# EAGLE design outseal328 (EAGLE 7.4.0)
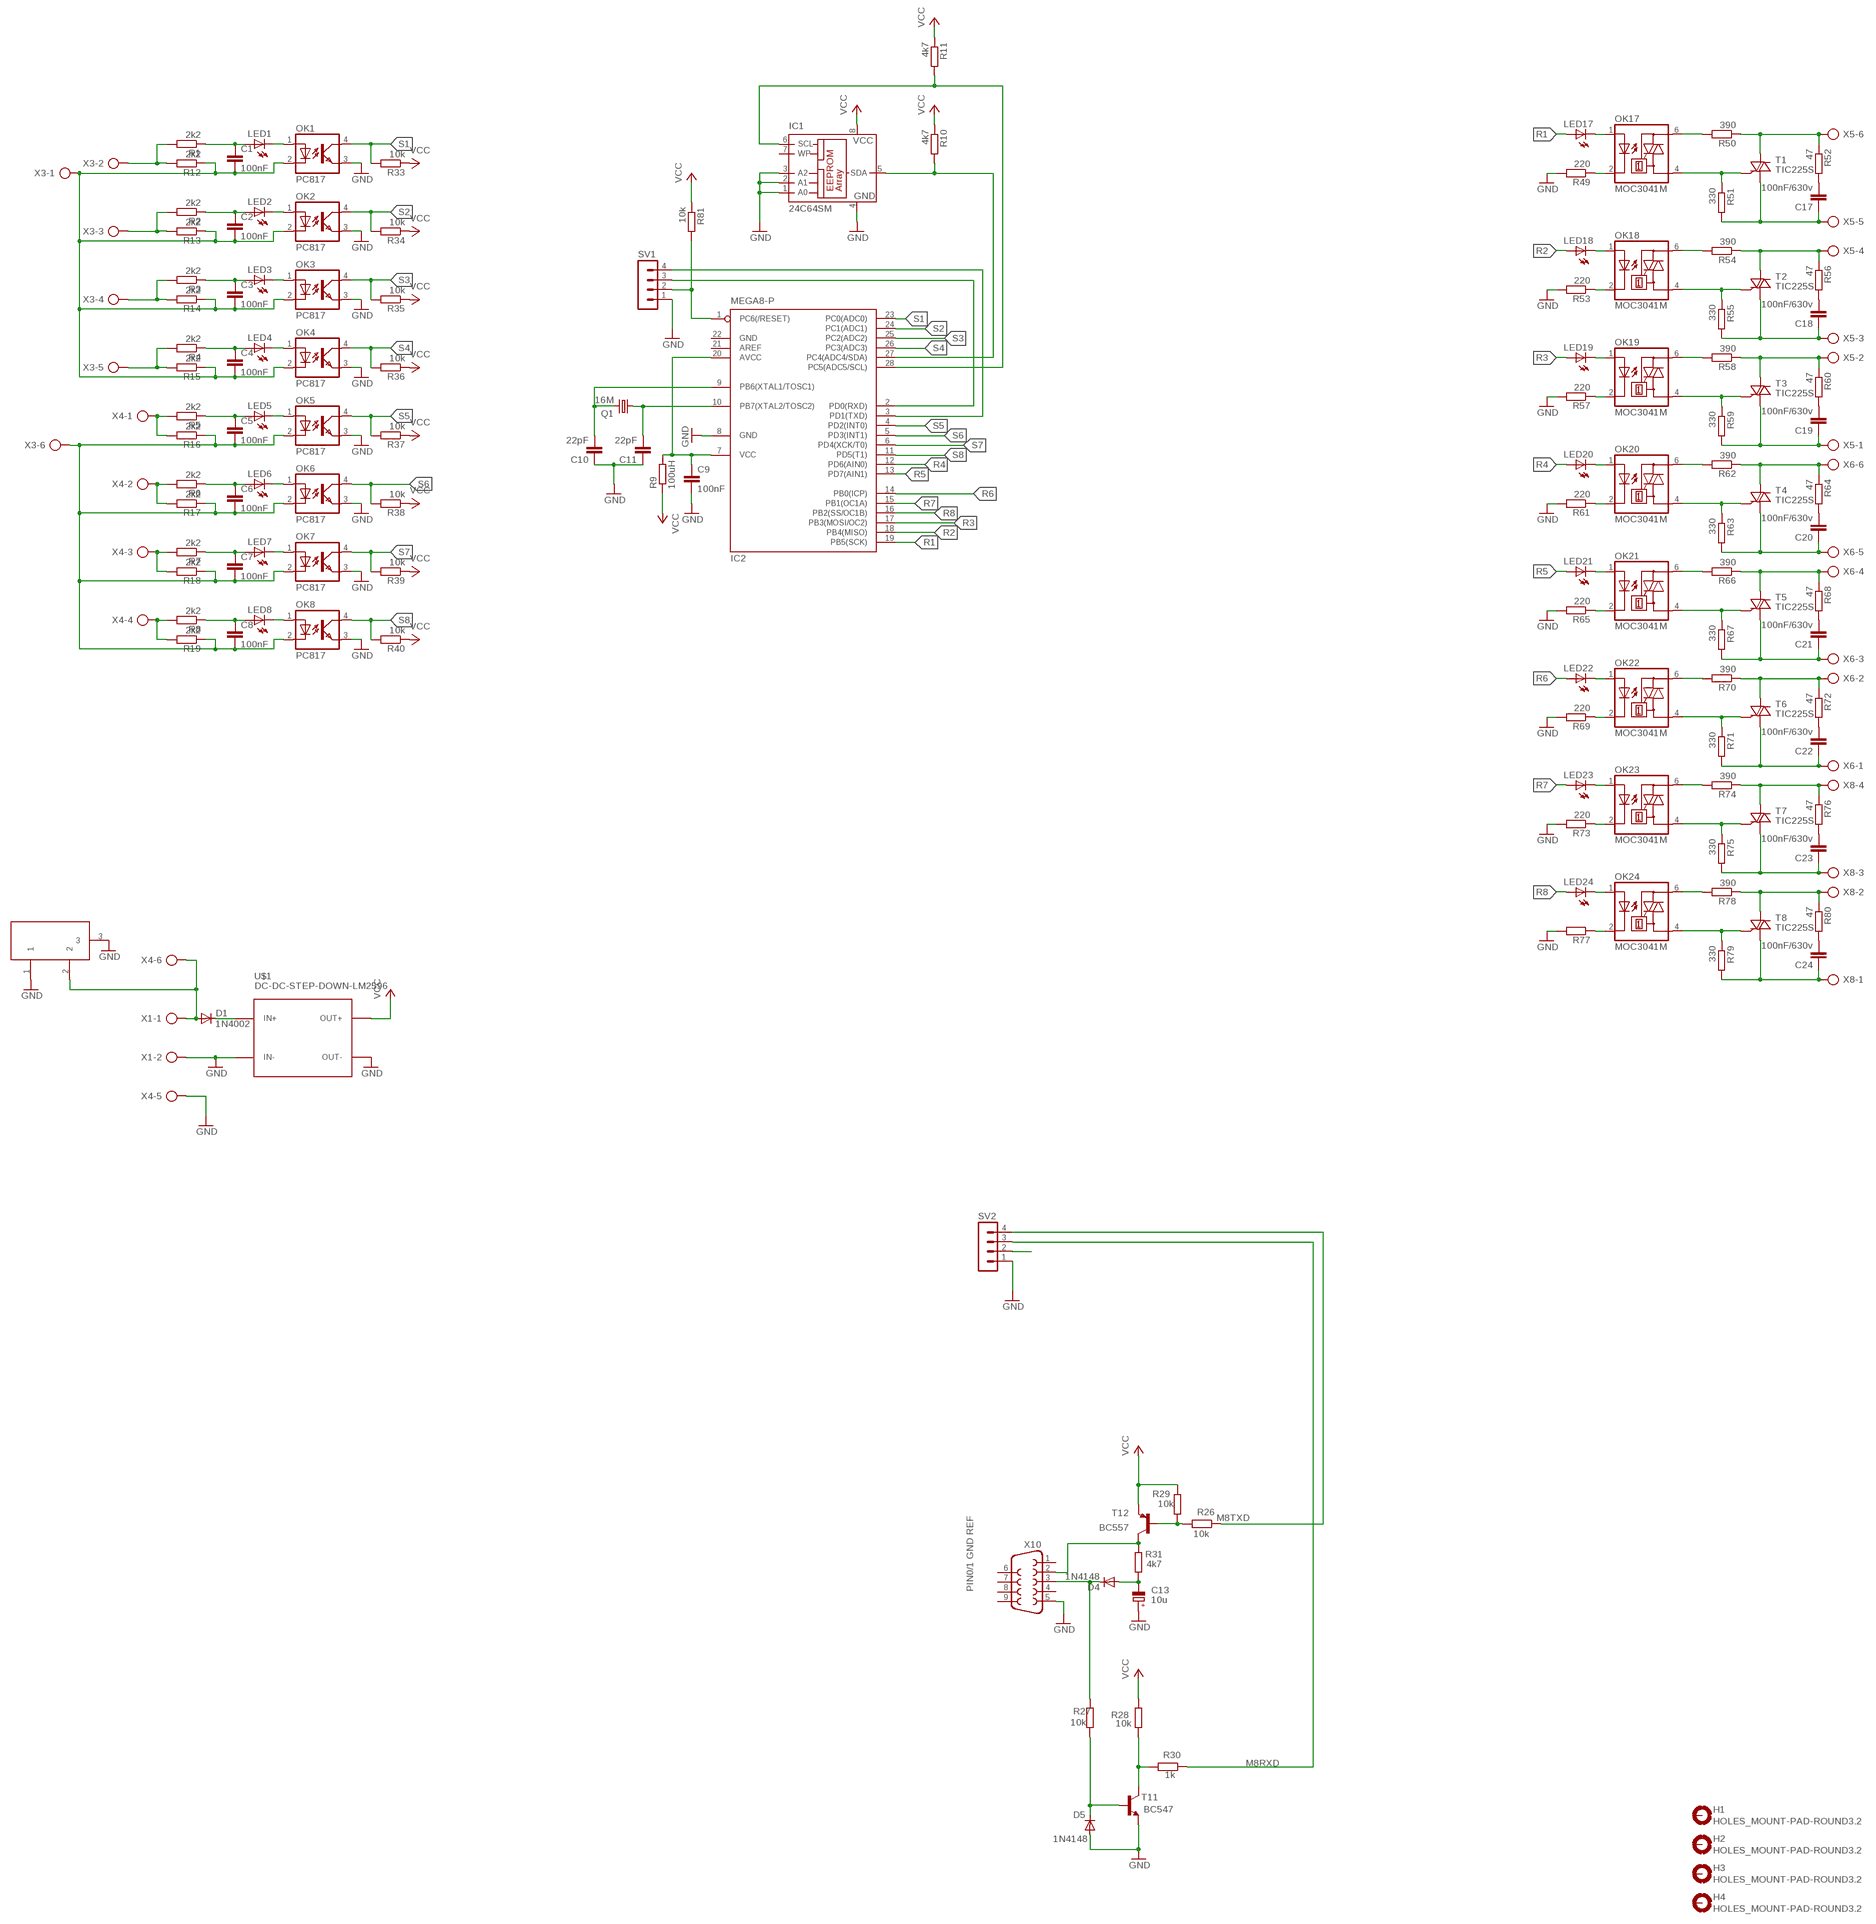
[diagram p0: schematic, sheet 1]

## Parts
C1  100nF  C-EU050-025X075  [C050-025X075]
C2  100nF  C-EU050-025X075  [C050-025X075]
C3  100nF  C-EU050-025X075  [C050-025X075]
C4  100nF  C-EU050-025X075  [C050-025X075]
C5  100nF  C-EU050-025X075  [C050-025X075]
C6  100nF  C-EU050-025X075  [C050-025X075]
C7  100nF  C-EU050-025X075  [C050-025X075]
C8  100nF  C-EU050-025X075  [C050-025X075]
C9  100nF  C-EU050-025X075  [C050-025X075]
C10  22pF  C-EU025-025X050  [C025-025X050]
C11  22pF  C-EU025-025X050  [C025-025X050]
C13  10u  CPOL-EUE5-6  [E5-6]
C17  100nF/630v  C-EU102-043X133  [C102-043X133]
C18  100nF/630v  C-EU102-043X133  [C102-043X133]
C19  100nF/630v  C-EU102-043X133  [C102-043X133]
C20  100nF/630v  C-EU102-043X133  [C102-043X133]
C21  100nF/630v  C-EU102-043X133  [C102-043X133]
C22  100nF/630v  C-EU102-043X133  [C102-043X133]
C23  100nF/630v  C-EU102-043X133  [C102-043X133]
C24  100nF/630v  C-EU102-043X133  [C102-043X133]
D1  1N4002  1N4446  [DO35-10@1]
D4  1N4148  [DO35-10]
D5  1N4148  [DO35-10]
H1  HOLES_MOUNT-PAD-ROUND3.2  [HOLES_3,2-PAD]
H2  HOLES_MOUNT-PAD-ROUND3.2  [HOLES_3,2-PAD]
H3  HOLES_MOUNT-PAD-ROUND3.2  [HOLES_3,2-PAD]
H4  HOLES_MOUNT-PAD-ROUND3.2  [HOLES_3,2-PAD]
IC1  24C64SM  [SO-08M]
IC2  MEGA8-P  [DIL28-3]
LED1  LED5MM  [LED5MM]
LED2  LED5MM  [LED5MM]
LED3  LED5MM  [LED5MM]
LED4  LED5MM  [LED5MM]
LED5  LED5MM  [LED5MM]
LED6  LED5MM  [LED5MM]
LED7  LED5MM  [LED5MM]
LED8  LED5MM  [LED5MM]
LED17  LED5MM  [LED5MM]
LED18  LED5MM  [LED5MM]
LED19  LED5MM  [LED5MM]
LED20  LED5MM  [LED5MM]
LED21  LED5MM  [LED5MM]
LED22  LED5MM  [LED5MM]
LED23  LED5MM  [LED5MM]
LED24  LED5MM  [LED5MM]
OK1  PC817  [DIL04]
OK2  PC817  [DIL04]
OK3  PC817  [DIL04]
OK4  PC817  [DIL04]
OK5  PC817  [DIL04]
OK6  PC817  [DIL04]
OK7  PC817  [DIL04]
OK8  PC817  [DIL04]
OK17  MOC3041M  [DIL06]
OK18  MOC3041M  [DIL06]
OK19  MOC3041M  [DIL06]
OK20  MOC3041M  [DIL06]
OK21  MOC3041M  [DIL06]
OK22  MOC3041M  [DIL06]
OK23  MOC3041M  [DIL06]
OK24  MOC3041M  [DIL06]
Q1  16M  CRYSTALHC49S  [HC49/S]
R1  2k2  R-EU_0207/10  [0207/10]
R2  2k2  R-EU_0207/10  [0207/10]
R3  2k2  R-EU_0207/10  [0207/10]
R4  2k2  R-EU_0207/10  [0207/10]
R5  2k2  R-EU_0207/10  [0207/10]
R6  2k2  R-EU_0207/10  [0207/10]
R7  2k2  R-EU_0207/10  [0207/10]
R8  2k2  R-EU_0207/10  [0207/10]
R9  100uH  R-EU_0207/10  [0207/10]
R10  4k7  R-EU_0207/10  [0207/10]
R11  4k7  R-EU_0207/10  [0207/10]
R12  2k2  R-EU_0207/10  [0207/10]
R13  2k2  R-EU_0207/10  [0207/10]
R14  2k2  R-EU_0207/10  [0207/10]
R15  2k2  R-EU_0207/10  [0207/10]
R16  2k2  R-EU_0207/10  [0207/10]
R17  2k2  R-EU_0207/10  [0207/10]
R18  2k2  R-EU_0207/10  [0207/10]
R19  2k2  R-EU_0207/10  [0207/10]
R26  10k  R-EU_0207/10  [0207/10]
R27  10k  R-EU_0207/10  [0207/10]
R28  10k  R-EU_0207/10  [0207/10]
R29  10k  R-EU_0207/10  [0207/10]
R30  1k  R-EU_0207/10  [0207/10]
R31  4k7  R-EU_0207/10  [0207/10]
R33  10k  R-EU_0207/10  [0207/10]
R34  10k  R-EU_0207/10  [0207/10]
R35  10k  R-EU_0207/10  [0207/10]
R36  10k  R-EU_0207/10  [0207/10]
R37  10k  R-EU_0207/10  [0207/10]
R38  10k  R-EU_0207/10  [0207/10]
R39  10k  R-EU_0207/10  [0207/10]
R40  10k  R-EU_0207/10  [0207/10]
R49  220  R-EU_0207/10  [0207/10]
R50  390  R-EU_0207/10  [0207/10]
R51  330  R-EU_0207/10  [0207/10]
R52  47  R-EU_0207/10  [0207/10]
R53  220  R-EU_0207/10  [0207/10]
R54  390  R-EU_0207/10  [0207/10]
R55  330  R-EU_0207/10  [0207/10]
R56  47  R-EU_0207/10  [0207/10]
R57  220  R-EU_0207/10  [0207/10]
R58  390  R-EU_0207/10  [0207/10]
R59  330  R-EU_0207/10  [0207/10]
R60  47  R-EU_0207/10  [0207/10]
R61  220  R-EU_0207/10  [0207/10]
R62  390  R-EU_0207/10  [0207/10]
R63  330  R-EU_0207/10  [0207/10]
R64  47  R-EU_0207/10  [0207/10]
R65  220  R-EU_0207/10  [0207/10]
R66  390  R-EU_0207/10  [0207/10]
R67  330  R-EU_0207/10  [0207/10]
R68  47  R-EU_0207/10  [0207/10]
R69  220  R-EU_0207/10  [0207/10]
R70  390  R-EU_0207/10  [0207/10]
R71  330  R-EU_0207/10  [0207/10]
R72  47  R-EU_0207/10  [0207/10]
R73  220  R-EU_0207/10  [0207/10]
R74  390  R-EU_0207/10  [0207/10]
R75  330  R-EU_0207/10  [0207/10]
R76  47  R-EU_0207/10  [0207/10]
R77  R-EU_0207/10  [0207/10]
R78  390  R-EU_0207/10  [0207/10]
R79  330  R-EU_0207/10  [0207/10]
R80  47  R-EU_0207/10  [0207/10]
R81  10k  R-EU_0207/10  [0207/10]
SV1  MA04-1  [MA04-1]
SV2  MA04-1  [MA04-1]
T1  TIC225S  [TO220DS]
T2  TIC225S  [TO220DS]
T3  TIC225S  [TO220DS]
T4  TIC225S  [TO220DS]
T5  TIC225S  [TO220DS]
T6  TIC225S  [TO220DS]
T7  TIC225S  [TO220DS]
T8  TIC225S  [TO220DS]
T11  BC547  [TO92]
T12  BC557  BC557B-PNP-TO92-EBC  [TO92-EBC]
U$1  DC-DC-STEP-DOWN-LM2596  [DC-DC-STEP-DOWN-LM2596]
U$2  12v-24v  POWERSUPPLY_DC21MMX  [POWERSUPPLY_DC-21MM]
X1  AK500/2  [AK500/2]
X3  AK500/6  [AK500/6]
X4  AK500/6  [AK500/6]
X5  AK500/6  [AK500/6]
X6  AK500/6  [AK500/6]
X8  AK500/4  [AK500/4]
X10  F09H  [F09H]

## Nets
GND: C9.2 C10.1 C11.1 C13.+ D5.A IC1.1(A0) IC1.2(A1) IC1.3(A2) IC1.4(GND) IC2.8(GND) OK1.3(EMIT) OK2.3(EMIT) OK3.3(EMIT) OK4.3(EMIT) OK5.3(EMIT) OK6.3(EMIT) OK7.3(EMIT) OK8.3(EMIT) R49.2 R53.2 R57.2 R61.2 R65.2 R69.2 R73.2 R77.2 SV1.1 SV2.1 T11.1(E) U$1.IN- U$1.OUT- U$2.1 U$2.3 X1.2 X4.5 X10.5
M8RXD: R30.1 SV2.3
M8TXD: R26.1 SV2.4
N$1: C1.1 LED1.A R1.1
N$2: C2.1 LED2.A R2.1
N$3: C3.1 LED3.A R3.1
N$4: C4.1 LED4.A R4.1
N$5: C5.1 LED5.A R5.1
N$6: C6.1 LED6.A R6.1
N$7: C7.1 LED7.A R7.1
N$8: C8.1 LED8.A R8.1
N$9: C11.2 IC2.10(PB7(XTAL2/TOSC2)) Q1.1
N$10: C10.2 IC2.9(PB6(XTAL1/TOSC1)) Q1.2
N$11: IC1.5(SDA) IC2.27(PC4(ADC4/SDA)) R10.2
N$12: LED1.K(C) OK1.1(A)
N$13: LED2.K(C) OK2.1(A)
N$14: LED3.K(C) OK3.1(A)
N$15: LED4.K(C) OK4.1(A)
N$16: LED5.K(C) OK5.1(A)
N$17: LED6.K(C) OK6.1(A)
N$18: LED7.K(C) OK7.1(A)
N$19: LED8.K(C) OK8.1(A)
N$20: IC2.2(PD0(RXD)) SV1.3
N$21: D1.A U$2.2 X1.1 X4.6
N$22: D1.C U$1.IN+
N$23: C9.1 IC2.7(VCC) IC2.20(AVCC) R9.2
N$24: IC1.6(SCL) IC2.28(PC5(ADC5/SCL)) R11.2
N$25: C1.2 C2.2 C3.2 C4.2 OK1.2(C) OK2.2(C) OK3.2(C) OK4.2(C) R12.1 R13.1 R14.1 R15.1 X3.1
N$26: SV2.2
N$29: C5.2 C6.2 C7.2 C8.2 OK5.2(C) OK6.2(C) OK7.2(C) OK8.2(C) R16.1 R17.1 R18.1 R19.1 X3.6
N$31: IC2.3(PD1(TXD)) SV1.4
N$32: R26.2 R29.2 T12.B
N$33: D5.C R27.1 T11.2(B)
N$34: R28.1 R30.2 T11.3(C)
N$35: C13.- D4.A R31.1
N$37: R8.2 R19.2 X4.4
N$38: R7.2 R18.2 X4.3
N$39: R6.2 R17.2 X4.2
N$40: R5.2 R16.2 X4.1
N$41: R4.2 R15.2 X3.5
N$42: R3.2 R14.2 X3.4
N$43: R2.2 R13.2 X3.3
N$44: R1.2 R12.2 X3.2
N$81: OK17.2(C) R49.1
N$82: LED17.K(C) OK17.1(A)
N$83: OK17.6(A2) R50.2
N$84: R50.1 R52.1 T1.A2 X5.6
N$85: OK17.4(A1) R51.1 T1.G
N$86: C17.1 R51.2 T1.A1 X5.5
N$87: C17.2 R52.2
N$88: LED18.K(C) OK18.1(A)
N$89: OK18.2(C) R53.1
N$90: OK18.6(A2) R54.2
N$91: R54.1 R56.1 T2.A2 X5.4
N$92: OK18.4(A1) R55.1 T2.G
N$93: C18.1 R55.2 T2.A1 X5.3
N$94: C18.2 R56.2
N$95: LED19.K(C) OK19.1(A)
N$96: OK19.2(C) R57.1
N$97: OK19.6(A2) R58.2
N$98: R58.1 R60.1 T3.A2 X5.2
N$99: OK19.4(A1) R59.1 T3.G
N$100: C19.1 R59.2 T3.A1 X5.1
N$101: C19.2 R60.2
N$102: LED20.K(C) OK20.1(A)
N$103: OK20.2(C) R61.1
N$104: OK20.6(A2) R62.2
N$105: R62.1 R64.1 T4.A2 X6.6
N$106: OK20.4(A1) R63.1 T4.G
N$107: C20.1 R63.2 T4.A1 X6.5
N$108: C20.2 R64.2
N$109: LED21.K(C) OK21.1(A)
N$110: OK21.2(C) R65.1
N$111: OK21.6(A2) R66.2
N$112: R66.1 R68.1 T5.A2 X6.4
N$113: OK21.4(A1) R67.1 T5.G
N$114: C21.1 R67.2 T5.A1 X6.3
N$115: C21.2 R68.2
N$116: LED22.K(C) OK22.1(A)
N$117: OK22.2(C) R69.1
N$118: OK22.6(A2) R70.2
N$119: R70.1 R72.1 T6.A2 X6.2
N$120: OK22.4(A1) R71.1 T6.G
N$121: C22.1 R71.2 T6.A1 X6.1
N$122: C22.2 R72.2
N$123: LED23.K(C) OK23.1(A)
N$124: OK23.2(C) R73.1
N$125: OK23.6(A2) R74.2
N$126: R74.1 R76.1 T7.A2 X8.4
N$127: OK23.4(A1) R75.1 T7.G
N$128: C23.1 R75.2 T7.A1 X8.3
N$129: C23.2 R76.2
N$130: LED24.K(C) OK24.1(A)
N$131: OK24.2(C) R77.1
N$132: OK24.6(A2) R78.2
N$133: R78.1 R80.1 T8.A2 X8.2
N$134: OK24.4(A1) R79.1 T8.G
N$135: C24.1 R79.2 T8.A1 X8.1
N$136: C24.2 R80.2
N$137: IC2.1(PC6(/RESET)) R81.2 SV1.2
R1: IC2.19(PB5(SCK)) LED17.A
R2: IC2.18(PB4(MISO)) LED18.A
R3: IC2.17(PB3(MOSI/OC2)) LED19.A
R4: IC2.12(PD6(AIN0)) LED20.A
R5: IC2.13(PD7(AIN1)) LED21.A
R6: IC2.14(PB0(ICP)) LED22.A
R7: IC2.15(PB1(OC1A)) LED23.A
R8: IC2.16(PB2(SS/OC1B)) LED24.A
RX1: D4.C R27.2 X10.3
S1: IC2.23(PC0(ADC0)) OK1.4(COL) R33.2
S2: IC2.24(PC1(ADC1)) OK2.4(COL) R34.2
S3: IC2.25(PC2(ADC2)) OK3.4(COL) R35.2
S4: IC2.26(PC3(ADC3)) OK4.4(COL) R36.2
S5: IC2.4(PD2(INT0)) OK5.4(COL) R37.2
S6: IC2.5(PD3(INT1)) OK6.4(COL) R38.2
S7: IC2.6(PD4(XCK/T0)) OK7.4(COL) R39.2
S8: IC2.11(PD5(T1)) OK8.4(COL) R40.2
TX1: R31.2 T12.C X10.2
VCC: IC1.8(VCC) R9.1 R10.1 R11.1 R28.2 R29.1 R33.1 R34.1 R35.1 R36.1 R37.1 R38.1 R39.1 R40.1 R81.1 T12.E U$1.OUT+
Unconnected: H1.B3,2(MOUNT) H2.B3,2(MOUNT) H3.B3,2(MOUNT) H4.B3,2(MOUNT) IC1.7(WP) IC2.21(AREF) X10.1 X10.4 X10.6 X10.7 X10.8 X10.9

## Notes on the sheet
- PIN0/1 GND REF

## Power pins joined to a net without a drawn wire
GND: IC2.22(GND)

## Library data of the parts
C1-C11 C17-C24 = rcl:C-EU: CAPACITOR, European symbol
C13 = rcl:CPOL-EU: POLARIZED CAPACITOR, European symbol
D1 = diode:1N4446: DIODE high speed (Philips)
D4 D5 = diode:1N4148: DIODE high speed (Philips)
H1-H4 = Mega8:HOLES_MOUNT-PAD-ROUND: MOUNTING PAD, round
IC1 = microchip:24*: Serial EEPROM I2C; MF: RAMTRON INTERNATIONAL CORP; MPN: FM24C64-S; OC_FARNELL: 9882685; OC_NEWARK: 98H0189
IC2 = atmel:MEGA8-P: MICROCONTROLLER 8 Kbytes FLASH, 1 kbytes SRAM, 512 bytes EEPROM, USART, 4-channel 10 bit ADC, 2-channel 8 bit ADC Pin compatible with Atmega48, ATMega88, ATMega168 Source: avr.lbr; OC_FARNELL: unknown; OC_NEWARK: unknown
LED1-LED8 LED17-LED24 = led:LED: LED OSRAM: - CHIPLED LG R971, LG N971, LY N971, LG Q971, LY Q971, LO R971, LY R971 LH N974, LH R974 LS Q976, LO Q976, LY Q976 LO Q996 - Hyper CHIPLED LW Q18S LB Q993, LB Q99A, LB R99A - SideLED LS A670, LO A670, LY A670, LG A670, LP A670 LB A673, LV A673, LT A673, LW A673 LH A674 LY A675 LS A676, LA A676, LO A676, LY A676, LW A676 LS A679, LY A679, LG A679 - Hyper Micro SIDELED® LS Y876, LA Y876, LO Y876, LY Y876 LT Y87S - SmartLED LW L88C, LW L88S LB L89C, LB L89S, LG L890 LS L89K, LO L89K, LY L89K LS L896, LA L896, LO L896, LY L896 - TOPLED LS T670, LO T670, LY T670, LG T670, LP T670 LSG T670, LSP T670, LSY T670, LOP T670, LYG T670 LG T671, LOG T671, LSG T671 LB T673, LV T673, LT T673, LW T673 LH T674 LS T676, LA T676, LO T676, LY T676, LB T676, LH T676, LSB T676, LW T676 LB T67C, LV T67C, LT T67C, LS T67K, LO T67K, LY T67K, LW E67C LS E67B, LA E67B, LO E67B, LY E67B, LB E67C, LV E67C, LT E67C LW T67C LS T679, LY T679, LG T679 LS T770, LO T770, LY T770, LG T770, LP T770 LB T773, LV T773, LT T773, LW T773 LH T774 LS E675, LA E675, LY E675, LS T675 LS T776, LA T776, LO T776, LY T776, LB T776 LHGB T686 LT T68C, LB T68C - Hyper Mini TOPLED® LB M676 - Mini TOPLED Santana® LG M470 LS M47K, LO M47K, LY M47K Source: http://www.osram.convergy.de LUXEON: - LUMILED® LXK2-PW12-R00, LXK2-PW12-S00, LXK2-PW14-U00, LXK2-PW14-V00 LXK2-PM12-R00, LXK2-PM12-S00, LXK2-PM14-U00 LXK2-PE12-Q00, LXK2-PE12-R00, LXK2-PE12-S00, LXK2-PE14-T00, LXK2-PE14-U00 LXK2-PB12-K00, LXK2-PB12-L00, LXK2-PB12-M00, LXK2-PB14-N00, LXK2-PB14-P00, LXK2-PB14-Q00 LXK2-PR12-L00, LXK2-PR12-M00, LXK2-PR14-Q00, LXK2-PR14-R00 LXK2-PD12-Q00, LXK2-PD12-R00, LXK2-PD12-S00 LXK2-PH12-R00, LXK2-PH12-S00 LXK2-PL12-P00, LXK2-PL12-Q00, LXK2-PL12-R00 Source: www.luxeon.com KINGBRIGHT: KA-3528ASYC Source: www.kingbright.com
OK1-OK8 = optocoupler:PC817: SHARP OPTO COUPLER; MPN: PC817X4J000F; OC_FARNELL: 9707727; OC_NEWARK: 97K7059
OK17-OK24 = optocoupler:MOC30*: 6-Pin DIP Zero-Cross Optoisolators Triac Driver Output (250/400 Volt Peak) Source: Data sheet <http://www.fairchildsemi.com/ds/MO/MOC3031M.pdf> The old path of data sheet not more available 2013-05-06.; MF: FAIRCHILD SEMICONDUCTOR; MPN: MOC3041M; OC_FARNELL: 1086677; OC_NEWARK: 78K6090
Q1 = crystal:CRYSTAL: CRYSTAL; OC_FARNELL: 1667008; OC_NEWARK: unknown
R1-R19 R26-R31 R33-R40 R49-R81 = rcl:R-EU_: RESISTOR, European symbol
SV1 SV2 = con-lstb:MA04-1: PIN HEADER; OC_FARNELL: unknown; OC_NEWARK: unknown
T1-T8 = triac:TIC225S: TRIAC
T11 = transistor:BC547: NPN TRANSISTOR
T12 = transistor:*-PNP-: PNP Transistror
U$1 = diy-modules:DC-DC-STEP-DOWN-LM2596: DC/DC Step-Down Regulator based on LM2596-ADJ chip LM2596 datasheet available here: http://www.ti.com/lit/ds/symlink/lm2596.pdf Click here to find device on ebay.com <http://www.ebay.com/sch/lm2596+power+regulator>
U$2 = Mega8:POWERSUPPLY_DC21MM
X1 = con-ptr500:AK500/2: CONNECTOR; OC_FARNELL: unknown; OC_NEWARK: unknown
X3-X6 = con-ptr500:AK500/6: CONNECTOR; OC_FARNELL: unknown; OC_NEWARK: unknown
X8 = con-ptr500:AK500/4: CONNECTOR; OC_FARNELL: unknown; OC_NEWARK: unknown
X10 = con-subd:F09: SUB-D

## Net classes
1 power: width 0.61 mm

## Board
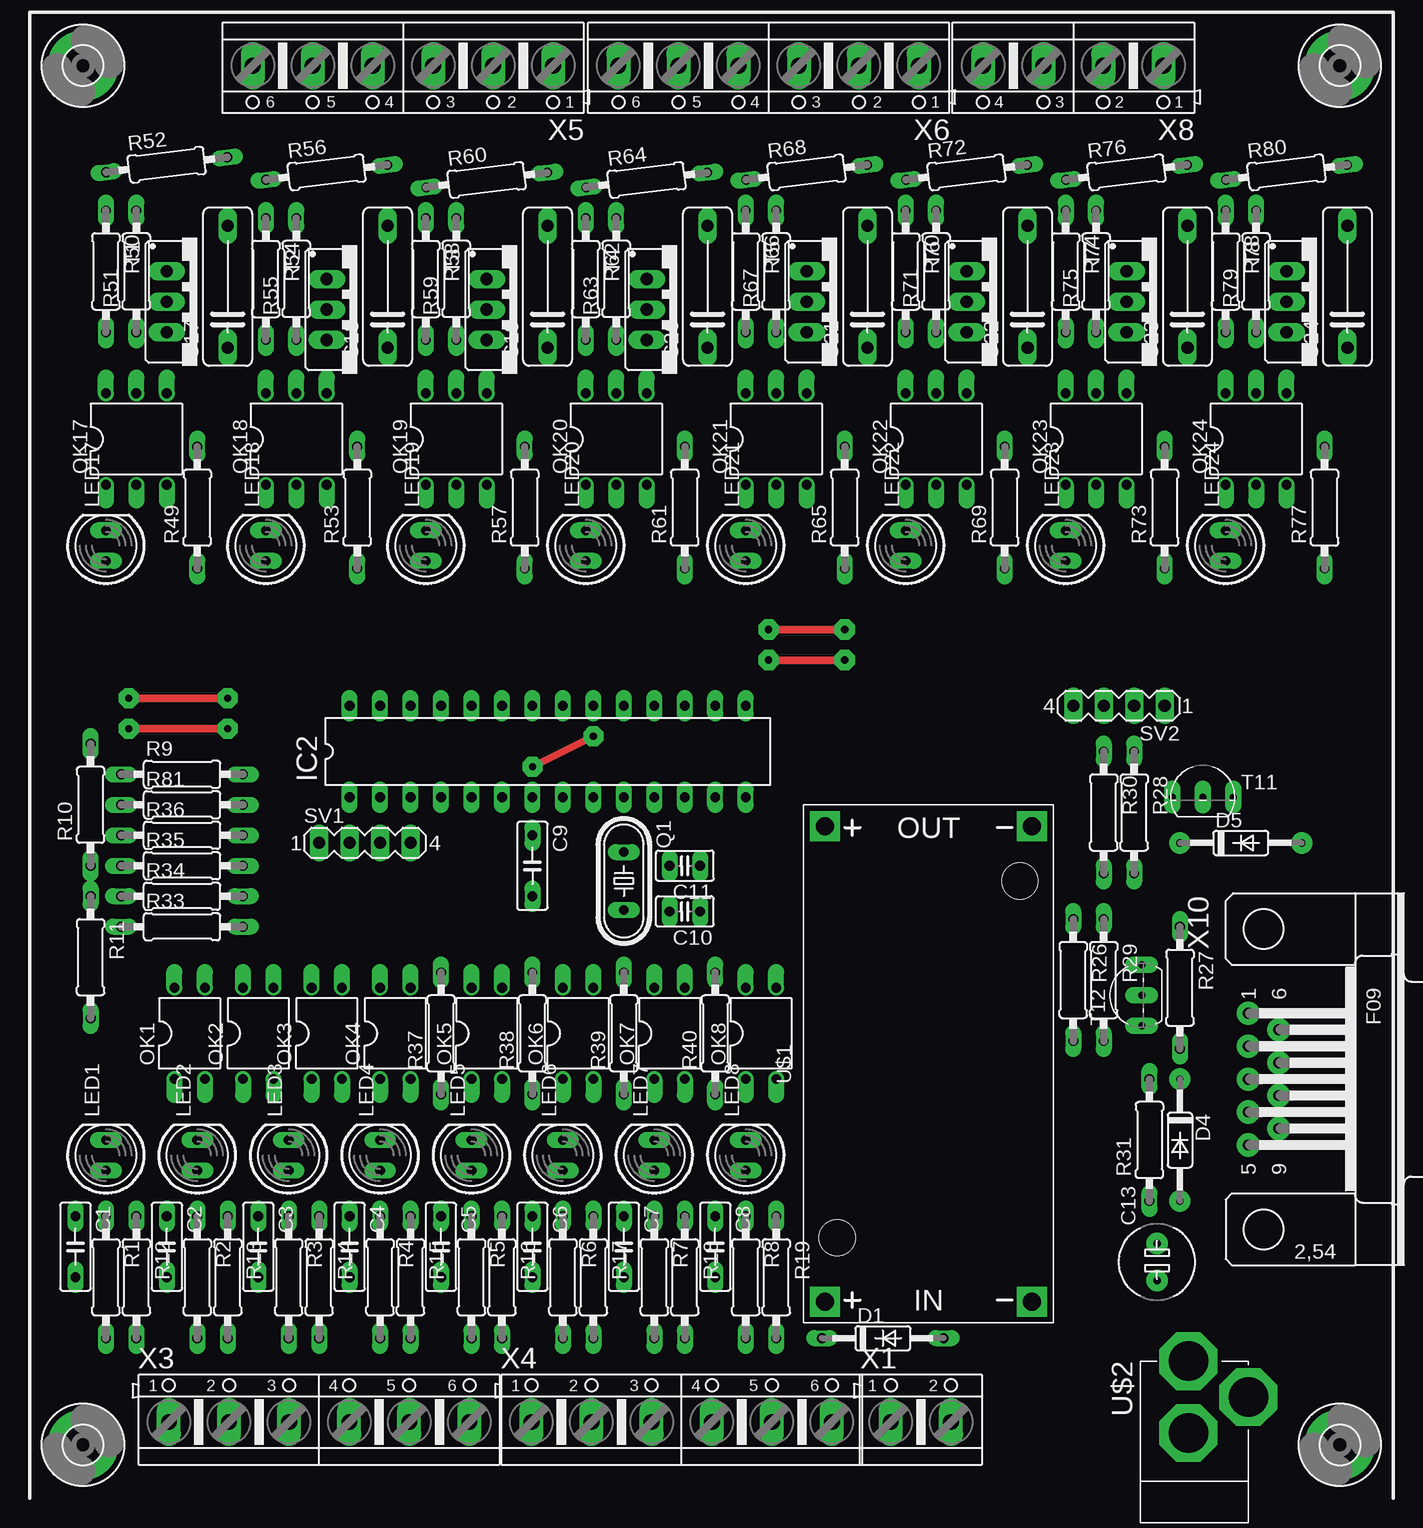
[diagram p1: board, top side]
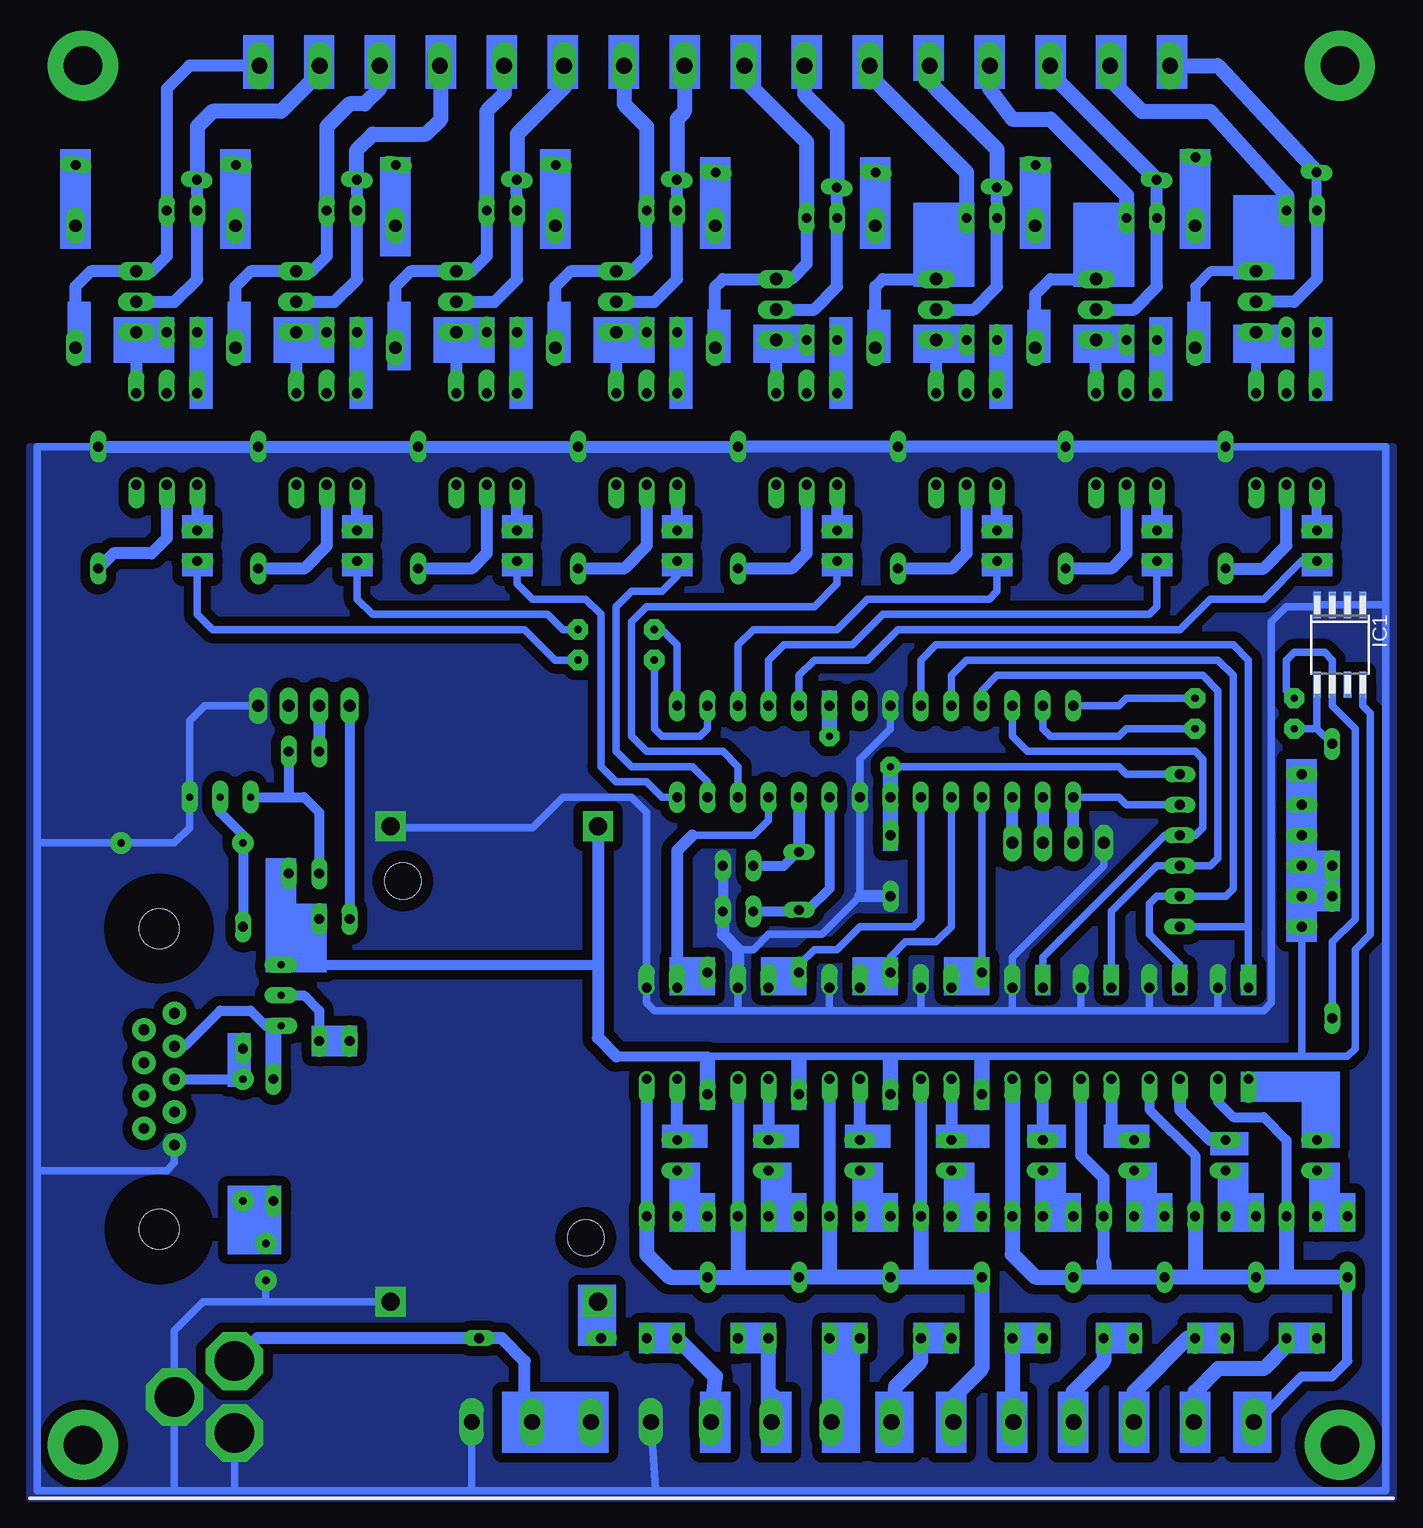
[diagram p2: board, bottom side, seen from below]

No outline drawn. Coordinates in mm, seen from the top.
Copper layers (1*16): Top 0.035mm / dielectric 1.5mm / Bottom 0.035mm
Design rules "default": minimum track width 10mil, minimum drill 24mil, track to track 8mil, track to pad 8mil, pad to pad 8mil, via to via 8mil, smd to smd 8mil, copper to edge 40mil, drill to drill 8mil, minimum pad ring 10mil, minimum via ring 8mil, stop-mask expansion 4mil, vias tented up to drill 0mil, thermal gap 10mil

### Footprints (pad centres in the part's own frame; a part is rotated, then mirrored left to right if it is on the bottom)
C050-025X075 = drill 0.813 long: 1 -2.54,0; 2 2.54,0
C025-025X050 = drill 0.813 long: 1 -1.27,0; 2 1.27,0
E5-6 = drill 0.6 pad 1.778: + -1.54,0; - 1.54,0
C102-043X133 = drill 1.016 long: 1 -5.08,0; 2 5.08,0
DO35-10@1 = drill 0.813 long: A 5.08,0; C -5.08,0
DO35-10 = drill 0.6 pad 1.778: A 5.08,0; C -5.08,0
HOLES_3,2-PAD = drill 3.2 pad 5.842: B3,2 0,0
SO-08M = smd 0.6 x 2.2: 1 -1.905,-3.33; 2 -0.635,-3.33; 3 0.635,-3.33; 4 1.905,-3.33; 5 1.905,3.33; 6 0.635,3.33; 7 -0.635,3.33; 8 -1.905,3.33
DIL28-3 = drill 0.813 long: 1 -16.51,-3.81; 2 -13.97,-3.81; 3 -11.43,-3.81; 4 -8.89,-3.81; 5 -6.35,-3.81; 6 -3.81,-3.81; 7 -1.27,-3.81; 8 1.27,-3.81; 9 3.81,-3.81; 10 6.35,-3.81; 11 8.89,-3.81; 12 11.43,-3.81; 13 13.97,-3.81; 14 16.51,-3.81; 15 16.51,3.81; 16 13.97,3.81; 17 11.43,3.81; 18 8.89,3.81; 19 6.35,3.81; 20 3.81,3.81; 21 1.27,3.81; 22 -1.27,3.81; 23 -3.81,3.81; 24 -6.35,3.81; 25 -8.89,3.81; 26 -11.43,3.81; 27 -13.97,3.81; 28 -16.51,3.81
LED5MM = drill 0.813 long: A -1.27,0; K 1.27,0
DIL04 = drill 0.813 offset: 1 -1.27,-3.81; 2 1.27,-3.81; 3 1.27,3.81; 4 -1.27,3.81
DIL06 = drill 0.813 offset: 1 -2.54,-3.81; 2 0,-3.81; 3 2.54,-3.81; 4 2.54,3.81; 5 0,3.81; 6 -2.54,3.81
HC49/S = drill 0.813 long: 1 -2.413,0; 2 2.413,0
0207/10 = drill 0.813 long: 1 -5.08,0; 2 5.08,0
MA04-1 = drill 1.016 long: 1 -3.81,0; 2 -1.27,0; 3 1.27,0; 4 3.81,0
TO220DS = drill 1.016 long: A1 -2.54,-2.54; A2 0,-2.54; G 2.54,-2.54
TO92 = drill 0.6 pad 1.372 long: 1 2.54,0; 2 0,0; 3 -2.54,0
TO92-EBC = drill 0.6 pad 1.372 long: B 0,-1.27; C -2.54,-1.27; E 2.54,-1.27
DC-DC-STEP-DOWN-LM2596 = drill 1.5 pad 2.5 square: IN+ -19.812,8.636; IN- -19.812,-8.636; OUT+ 19.812,8.636; OUT- 19.812,-8.636 | hole 3: -14.478,7.62; 15.24,-7.62
POWERSUPPLY_DC-21MM = drill 3.302 pad 4.826 octagon: 1 -5.08,-3.353; 2 -0.076,-6.35; 3 -0.076,-0.356
AK500/2 = drill 1.321 long: 1 -2.515,0; 2 2.515,0
AK500/6 = drill 1.321 long: 1 -12.522,0; 2 -7.518,0; 3 -2.515,0; 4 2.515,0; 5 7.518,0; 6 12.522,0
AK500/4 = drill 1.321 long: 1 -7.518,0; 2 -2.489,0; 3 2.489,0; 4 7.518,0
F09H = drill 0.9 pad 1.93: 1 -5.486,-1.27; 2 -2.743,-1.27; 3 0,-1.27; 4 2.743,-1.27; 5 5.486,-1.27; 6 -4.115,1.27; 7 -1.372,1.27; 8 1.372,1.27; 9 4.115,1.27 | hole 3.302: -12.522,0; 12.522,0

### Placement (x,y rotation side)
C1  4.45,20.95 270 top
C2  12.06,20.95 270 top
C3  19.68,20.95 270 top
C4  27.3,20.95 270 top
C5  34.92,20.95 270 top
C6  42.55,20.95 270 top
C7  50.16,20.95 270 top
C8  57.78,20.95 270 top
C9  42.55,52.7 270 top
C10  55.24,48.9 180 top
C11  55.24,52.7 180 top
C13  94.61,19.68 90 top
C17  17.14,100.97 90 top
C18  30.48,100.97 90 top
C19  43.81,100.97 90 top
C20  57.15,100.97 90 top
C21  70.48,100.97 90 top
C22  83.82,100.97 90 top
C23  97.16,100.97 90 top
C24  110.49,100.97 90 top
D1  71.75,13.34 0 top
D4  96.52,29.84 270 top
D5  101.6,54.61 0 top
H1  5.08,4.45 0 top
H2  109.86,4.45 0 top
H3  109.86,119.38 0 top
H4  5.08,119.38 0 top
IC1  5.08,71.12 180 bottom
IC2  43.81,62.23 0 top
LED1  6.99,28.57 90 top
LED2  14.61,28.57 90 top
LED3  22.23,28.57 90 top
LED4  29.84,28.57 90 top
LED5  37.47,28.57 90 top
LED6  45.09,28.57 90 top
LED7  52.7,28.57 90 top
LED8  60.33,28.57 90 top
LED17  6.99,79.38 90 top
LED18  20.32,79.38 90 top
LED19  33.66,79.38 90 top
LED20  46.99,79.38 90 top
LED21  60.33,79.38 90 top
LED22  73.66,79.38 90 top
LED23  87,79.38 90 top
LED24  100.33,79.38 90 top
OK1  13.97,38.73 0 top
OK2  19.68,38.73 0 top
OK3  25.4,38.73 0 top
OK4  31.11,38.73 0 top
OK5  38.73,38.73 0 top
OK6  46.35,38.73 0 top
OK7  53.98,38.73 0 top
OK8  61.59,38.73 0 top
OK17  9.53,88.27 0 top
OK18  22.86,88.27 0 top
OK19  36.2,88.27 0 top
OK20  49.53,88.27 0 top
OK21  62.87,88.27 0 top
OK22  76.2,88.27 0 top
OK23  89.53,88.27 0 top
OK24  102.87,88.27 0 top
Q1  50.16,51.44 270 top
R1  6.99,18.41 270 top
R2  14.61,18.41 270 top
R3  22.23,18.41 270 top
R4  29.84,18.41 270 top
R5  37.47,18.41 270 top
R6  45.09,18.41 270 top
R7  52.7,18.41 270 top
R8  60.33,18.41 270 top
R9  13.34,60.33 0 top
R10  5.71,57.78 90 top
R11  5.71,45.09 270 top
R12  9.53,18.41 270 top
R13  17.14,18.41 270 top
R14  24.77,18.41 270 top
R15  32.38,18.41 270 top
R16  40.01,18.41 270 top
R17  47.62,18.41 270 top
R18  55.24,18.41 270 top
R19  62.87,18.41 270 top
R26  87.63,43.18 270 top
R27  96.52,42.55 270 top
R28  92.71,57.15 270 top
R29  90.17,43.18 270 top
R30  90.17,57.15 270 top
R31  93.98,29.84 90 top
R33  13.34,47.62 0 top
R34  13.34,50.16 0 top
R35  13.34,52.7 0 top
R36  13.34,55.24 0 top
R37  34.92,38.73 90 top
R38  42.55,38.73 90 top
R39  50.16,38.73 90 top
R40  57.78,38.73 90 top
R49  14.61,82.55 90 top
R50  6.99,102.23 270 top
R51  9.53,102.23 90 top
R52  12.06,111.12 7 top
R53  27.94,82.55 90 top
R54  20.32,101.6 270 top
R55  22.86,101.6 90 top
R56  25.4,110.49 7 top
R57  41.91,82.55 90 top
R58  33.66,101.6 270 top
R59  36.2,101.6 90 top
R60  38.73,109.86 7 top
R61  55.24,82.55 90 top
R62  46.99,101.6 270 top
R63  49.53,101.6 90 top
R64  52.07,109.86 7 top
R65  68.58,82.55 90 top
R66  60.33,102.23 270 top
R67  62.87,102.23 90 top
R68  65.41,110.49 7 top
R69  81.92,82.55 90 top
R70  73.66,102.23 270 top
R71  76.2,102.23 90 top
R72  78.74,110.49 7 top
R73  95.25,82.55 90 top
R74  87,102.23 270 top
R75  89.53,102.23 90 top
R76  92.08,110.49 7 top
R77  108.58,82.55 90 top
R78  100.33,102.23 270 top
R79  102.87,102.23 90 top
R80  105.41,110.49 7 top
R81  13.34,57.78 0 top
SV1  28.57,54.61 0 top
SV2  91.44,66.04 180 top
T1  14.61,99.69 270 top
T2  27.94,99.06 270 top
T3  41.27,99.06 270 top
T4  54.61,99.06 270 top
T5  67.94,99.69 270 top
T6  81.28,99.69 270 top
T7  94.61,99.69 270 top
T8  107.95,99.69 270 top
T11  98.42,58.42 0 top
T12  92.08,41.91 90 top
U$1  75.56,36.2 90 top
U$2  97.16,5.08 180 top
X1  74.93,6.35 0 top
X3  24.77,6.35 0 top
X4  54.99,6.35 0 top
X5  31.75,119.38 180 top
X6  62.23,119.38 180 top
X8  87.63,119.38 180 top
X10  103.5,34.92 270 top

### Tracks (layer width: path | path; a pad name or v marks a point on that pad's centre or on a via)
GND
  Bottom 0.61: 113.67,27.3 113.67,0.64 102.23,0.64 | 113.67,27.3 113.67,54.61 | 113.67,54.61 113.67,87.63 R77.2 | R49.2 1.27,87.63 1.27,74.3 | 1.27,74.3 1.27,0.64 62.23,0.64 | IC2.22 42.55,64.14 45.09,61.59 IC2.8 45.09,50.16 48.26,46.99 52.7,46.99 53.98,45.72 55.24,45.72 | 32.38,40.64 OK4.3 32.38,45.09 24.77,52.7 SV1.1 | 15.24,40.64 20.95,40.64 | 20.95,40.64 26.67,40.64 | 26.67,40.64 32.38,40.64 | OK3.3 26.67,40.64 | OK2.3 20.95,40.64 | U$1.OUT- 84.07,55.88 72.39,55.88 69.85,58.42 64.14,58.42 62.87,57.15 OK8.3 62.87,41.27 62.23,40.64 55.24,40.64 | 102.23,0.64 97.16,0.64 | 97.16,0.64 77.47,0.64 | 77.47,0.64 62.23,0.64 | 15.24,40.64 11.43,40.64 10.79,41.27 10.79,73.03 9.53,74.3 7.14,74.3 IC1.4 IC1.3 IC1.2 IC1.1 1.43,74.45 1.27,74.3 | OK1.3 15.24,40.64 | 32.38,40.64 40.01,40.64 | 40.01,40.64 47.62,40.64 | 47.62,40.64 55.24,40.64 | OK7.3 55.24,40.64 | OK6.3 47.62,40.64 | OK5.3 40.01,40.64 | U$1.IN- 94.61,16.38 | 94.61,16.38 99.82,16.38 102.23,13.97 U$2.1 102.23,0.64 | X4.5 62.13,0.74 62.23,0.64 | 113.67,54.61 D5.A 102.23,54.61 100.97,55.88 T11.1 100.97,64.77 99.69,66.04 SV2.1 | C13.+ 94.61,16.38 | X10.5 102.23,27.94 102.87,27.3 113.67,27.3 | X1.2 77.44,0.66 77.47,0.64 | U$2.3 97.23,0.71 97.16,0.64
  Bottom 0.813: C11.1 C10.1
  Bottom 1.016: R49.2 R53.2 R57.2 R61.2 R65.2 R69.2 R73.2 R77.2 | C10.1 56.52,46.99 55.24,45.72 OK7.3 | C9.2 45.09,50.16
  pour Bottom (isolate 0.813, no thermals): 0.64,87.63 114.3,87.63 114.3,0 0.64,0
M8RXD
  Bottom 1.016: SV2.3 R30.1
M8TXD
  Bottom 0.813: SV2.4 R26.1
N$1
  Bottom 1.016: C1.1 R1.1 LED1.A
N$2
  Bottom 1.016: LED2.A R2.1 C2.1
N$3
  Bottom 1.016: LED3.A R3.1 C3.1
N$4
  Bottom 1.016: LED4.A R4.1 C4.1
N$5
  Bottom 1.016: LED5.A R5.1 C5.1
N$6
  Bottom 1.016: LED6.A R6.1 C6.1
N$7
  Bottom 1.016: LED7.A R7.1 C7.1
N$8
  Bottom 1.016: LED8.A R8.1 C8.1
N$9
  Bottom 0.813: C11.2 51.44,52.7 50.29,53.85 50.29,53.98 Q1.1
  Bottom 1.016: IC2.10 Q1.1
N$10
  Bottom 0.813: C10.2 50.29,48.9 Q1.2 49.4,49.02 47.62,50.8 IC2.9
N$11  (via drill 0.6 pad 1.68)
  Top 0.61: v8.89,64.14 v17.14,64.14
  Bottom 0.61: IC2.27 29.84,64.14 29.21,63.5 23.5,63.5 22.86,64.14 v17.14,64.14 | IC1.5 6.99,64.14 | 6.99,64.14 v8.89,64.14 | R10.2 6.99,64.14
N$12
  Bottom 1.016: OK1.1 8.26,34.92 6.99,33.66 LED1.K
N$13
  Bottom 1.016: OK2.1 18.41,32.38 15.88,29.84 LED2.K
N$14
  Bottom 1.016: OK3.1 24.13,30.48 23.5,29.84 LED3.K
N$15
  Bottom 1.016: LED4.K OK4.1
N$16
  Bottom 1.016: OK5.1 LED5.K
N$17
  Bottom 1.016: LED6.K OK6.1
N$18
  Bottom 1.016: OK7.1 LED7.K
N$19
  Bottom 1.016: LED8.K OK8.1
N$20
  Bottom 1.016: IC2.2 SV1.3
N$21
  Bottom 0.61: X4.6 X1.1
  Bottom 1.016: X1.1 72.39,7.62 73.05,8.28 73.05,10.77 73.03,11.43 74.93,13.34 D1.A 95.33,13.34 U$2.2
N$22
  Bottom 1.016: U$1.IN+ 66.93,13.59 D1.C
N$23  (via drill 0.6 pad 1.68)
  Top 0.61: v42.55,60.96 v47.62,63.5
  Bottom 0.61: R9.2 22.86,60.33 23.5,60.96 v42.55,60.96 IC2.7 C9.1 | v47.62,63.5 IC2.20
N$24  (via drill 0.6 pad 1.68)
  Top 0.61: v8.89,66.67 v17.14,66.67
  Bottom 0.61: v8.89,66.67 9.53,67.31 9.53,69.85 8.89,70.48 6.35,70.48 5.71,69.85 IC1.6 5.71,66.04 3.81,64.14 3.81,48.26 5.71,46.35 R11.2 | v17.14,66.67 22.86,66.67 23.5,66.04 IC2.28
N$25
  Bottom 0.813: X3.1 12.06,6.35 8.26,10.16 5.71,10.16 4.45,11.43 C1.2 | OK2.2 20.95,32.38 17.14,28.57 R13.1 | OK1.2 15.24,33.02 13.97,31.75 11.43,31.75 9.53,29.84 R12.1
  Bottom 1.016: OK3.2 26.67,28.57 24.77,26.67 R14.1 24.77,19.68
  Bottom 1.27: C1.2 9.53,18.41 | 9.53,18.41 C2.2 17.14,18.41 | 17.14,18.41 C3.2 24.77,18.41 | 24.77,18.41 C4.2 30.48,18.41 32.38,20.32 R15.1 OK4.2 | 24.77,19.68 24.77,18.41 | R13.1 17.14,18.41 | R12.1 9.53,18.41
N$29
  Bottom 1.016: OK7.2 R18.1 | OK5.2 R16.1 | OK6.2 R17.1 | OK8.2 R19.1
  Bottom 1.27: X3.6 37.47,6.53 37.47,8.26 34.92,10.79 C5.2 40.01,18.41 | 40.01,18.41 C6.2 47.62,18.41 | 47.62,18.41 C7.2 55.24,18.41 | R19.1 62.87,20.32 60.96,18.41 C8.2 55.24,18.41 | R18.1 55.24,18.41 | R17.1 47.62,18.41 | R16.1 40.01,18.41
N$31
  Bottom 1.016: SV1.4 IC2.3
N$32
  Bottom 0.813: R26.2 R29.2 90.17,40.64 91.44,41.91 T12.B
N$33
  Bottom 0.813: R27.1 D5.C 96.52,55.24 98.42,57.15 T11.2
N$34
  Bottom 0.813: T11.3 92.71,58.42 | 92.71,58.42 91.44,58.42 90.17,57.15 R30.2 | R28.1 92.71,58.42
N$35
  Bottom 0.813: C13.- R31.1 D4.A
N$37
  Bottom 1.016: R19.2 R8.2
  Bottom 1.27: R8.2 57.12,10.13 X4.4
N$38
  Bottom 1.016: R18.2 R7.2
  Bottom 1.27: X4.3 52.09,8.28 52.7,8.89 R7.2
N$39
  Bottom 1.016: R17.2 R6.2
  Bottom 1.27: X4.2 47.09,8.36 47.62,8.89 R17.2
N$40
  Bottom 1.016: R5.2 R16.2
  Bottom 1.27: R16.2 40.01,11.43 42.09,9.35 X4.1
N$41
  Bottom 1.016: R4.2 R15.2
  Bottom 1.27: R15.2 32.38,6.45 X3.5
N$42
  Bottom 1.016: R3.2 R14.2
  Bottom 1.27: R14.2 24.77,11.43 27.3,8.89 27.3,6.38 X3.4
N$43
  Bottom 1.016: R2.2 R13.2
  Bottom 1.27: R13.2 17.78,13.34 22.23,8.89 22.23,6.38 X3.3
N$44
  Bottom 1.016: R1.2 R12.2
  Bottom 1.27: R12.2 9.53,12.7 11.43,10.79 15.24,10.79 17.14,8.89 17.14,6.45 X3.2
N$81
  Bottom 1.016: R49.1 11.43,77.47 9.53,79.38 OK17.2
N$82
  Bottom 0.813: LED17.K OK17.1
N$83
  Bottom 0.813: OK17.6 R50.2
N$84
  Bottom 0.813: R50.1 R52.1
  Bottom 1.016: R50.1 6.99,101.6 8.89,99.69 T1.A2
  Bottom 1.27: X5.6 15.26,119.38 R52.1
N$85
  Bottom 0.813: OK17.4 T1.G R51.1
N$86
  Bottom 0.813: R51.2 9.53,103.5 10.16,102.87 T1.A1 15.88,102.23 17.14,100.97 C17.1
  Bottom 1.27: X5.5 24.23,118.21 21.59,115.57 15.88,115.57 9.53,108.58 R51.2
N$87
  Bottom 1.016: R52.2 17.07,106.12 C17.2
N$88
  Bottom 1.016: OK18.1 LED18.K
N$89
  Bottom 1.016: OK18.2 22.86,78.74 24.13,77.47 R53.1
N$90
  Bottom 1.016: R54.2 OK18.6
N$91
  Bottom 1.016: T2.A2 22.23,99.06 20.32,100.97 R54.1 R56.1
  Bottom 1.27: X5.4 29.23,118.77 28.57,118.11 R56.1
N$92
  Bottom 1.016: OK18.4 T2.G R55.1
N$93
  Bottom 1.016: R55.2 22.86,103.5 24.13,102.23 T2.A1 29.21,101.6 30.48,100.33 C18.1
  Bottom 1.27: X5.3 34.27,117.45 34.29,117.47 32.38,114.94 29.21,114.94 22.86,108.58 R55.2
N$94
  Bottom 1.016: C18.2 R56.2
N$95
  Bottom 1.016: LED19.K OK19.1
N$96
  Bottom 1.016: OK19.2 36.2,78.74 37.47,77.47 R57.1
N$97
  Bottom 1.016: R58.2 OK19.6
N$98
  Bottom 1.016: R60.1 R58.1 33.66,100.97 35.56,99.06 T3.A2
  Bottom 1.27: X5.2 39.27,118.64 39.27,118.01 38.73,117.47 33.66,112.39 33.66,109.27 R60.1
N$99
  Bottom 1.016: R59.1 T3.G OK19.4
N$100
  Bottom 1.016: R59.2 36.2,102.87 37.47,101.6 T3.A1 | 39.37,101.6 T3.A1 | C19.1 43.81,100.97 43.18,101.6 T3.A1
  Bottom 1.27: X5.1 44.27,119.2 44.27,118.57 43.18,117.47 36.2,110.49 R59.2
N$101
  Bottom 1.016: R60.2 C19.2
N$102
  Bottom 1.016: OK20.1 LED20.K
N$103
  Bottom 1.016: OK20.2 49.53,78.74 50.8,77.47 R61.1
N$104
  Bottom 1.016: R62.2 OK20.6
N$105
  Bottom 1.016: R64.1 R62.1 46.99,100.97 48.9,99.06 T4.A2
  Bottom 1.27: X6.6 49.71,117.02 46.99,114.3 46.99,109.27 R64.1
N$106
  Bottom 1.016: R63.1 T4.G OK20.4
N$107
  Bottom 1.016: C20.1 57.15,100.97 56.52,101.6 T4.A1 50.8,101.6 49.53,102.87 R63.2
  Bottom 1.27: X6.5 54.71,118.21 49.53,113.03 R63.2
N$108
  Bottom 1.016: R64.2 C20.2
N$109
  Bottom 1.016: LED21.K OK21.1
N$110
  Bottom 1.016: OK21.2 62.87,79.38 64.77,77.47 R65.1
N$111
  Bottom 1.016: R66.2 OK21.6
N$112
  Bottom 1.016: R68.1 R66.1 60.33,101.6 62.23,99.69 T5.A2
  Bottom 1.27: X6.4 59.72,115.55 60.33,114.94 60.33,109.91 R68.1
N$113
  Bottom 1.016: R67.1 T5.G OK21.4
N$114
  Bottom 1.016: R67.2 62.87,103.5 64.14,102.23 T5.A1 69.22,102.23 70.48,100.97 C21.1
  Bottom 1.27: X6.3 64.75,116.18 62.87,114.3 R67.2
N$115
  Bottom 1.016: R68.2 C21.2
N$116
  Bottom 1.016: LED22.K OK22.1
N$117
  Bottom 1.016: OK22.2 76.2,78.74 77.47,77.47 R69.1
N$118
  Bottom 1.016: R70.2 OK22.6
N$119
  Bottom 1.016: R72.1 R70.1 73.66,101.6 75.56,99.69 T6.A2
  Bottom 1.27: X6.2 69.75,117.58 73.66,113.67 73.66,109.91 R72.1
N$120
  Bottom 1.016: R71.1 T6.G OK22.4
N$121
  Bottom 1.016: R71.2 76.2,103.5 77.47,102.23 T6.A1 82.55,102.23 83.82,100.97 C22.1
  Bottom 1.27: X6.1 74.75,117.02 76.2,115.57 R71.2
N$122
  Bottom 1.016: R72.2 C22.2
N$123
  Bottom 1.016: LED23.K OK23.1
N$124
  Bottom 1.016: OK23.2 89.53,79.38 91.44,77.47 R73.1
N$125
  Bottom 1.016: R74.2 OK23.6
N$126
  Bottom 1.016: R76.1 R74.1 87,101.6 88.9,99.69 T7.A2
  Bottom 1.27: R76.1 87.03,112.36 85.72,113.67 81.28,113.67 80.01,114.94 80.01,119.28 X8.4
N$127
  Bottom 1.016: R75.1 T7.G OK23.4
N$128
  Bottom 1.016: R75.2 89.53,103.5 90.81,102.23 T7.A1 95.89,102.23 97.16,100.97 C23.1
  Bottom 1.27: X8.3 85.14,117.42 86.36,116.2 87.63,116.2 89.53,114.3 R75.2
N$129
  Bottom 1.016: R76.2 C23.2
N$130
  Bottom 1.016: OK24.1 LED24.K
N$131
  Bottom 1.016: OK24.2 102.87,80.01 104.14,78.74 107.31,78.74 R77.1
N$132
  Bottom 1.016: OK24.6 R78.2 100.33,97.79
N$133
  Bottom 1.016: R80.1 R78.1 100.33,101.6 102.23,99.69 T8.A2
  Bottom 1.27: X8.2 90.12,118.8 93.34,115.57 99.06,115.57 100.33,114.3 100.33,109.91 R80.1
N$134
  Bottom 1.016: R79.1 T8.G OK24.4
N$135
  Bottom 1.016: C24.1 110.49,100.97 109.22,102.23 T8.A1 104.14,102.23 102.87,103.5 R79.2 102.87,117.47 100.97,119.38 X8.1
N$136
  Bottom 1.016: C24.2 R80.2
N$137
  Bottom 0.61: IC2.1 23.5,58.42 22.86,57.78 R81.2
  Bottom 1.016: SV1.2 IC2.1
R1
  Bottom 0.61: LED17.A 8.26,78.11 11.43,74.93 15.88,74.93 18.41,72.39 41.91,72.39 44.45,69.85 48.9,69.85 50.16,68.58 IC2.19
R2
  Bottom 0.61: LED18.A 20.32,74.3 20.95,73.66 43.18,73.66 45.72,71.12 51.44,71.12 52.7,69.85 IC2.18
R3
  Bottom 0.61: LED19.A 33.66,75.56 34.29,74.93 44.45,74.93 46.99,72.39 53.98,72.39 55.24,71.12 IC2.17
R4
  Bottom 0.61: IC2.12 55.24,60.96 56.52,62.23 62.87,62.23 64.14,63.5 64.14,73.03 62.87,74.3 48.9,74.3 46.99,76.2 LED20.A
R5
  Bottom 0.61: IC2.13 57.78,59.69 59.05,60.96 64.14,60.96 65.41,62.23 65.41,74.3 64.14,75.56 61.59,75.56 60.33,76.83 LED21.A
R6
  Bottom 0.61: IC2.14 61.59,58.42 62.87,59.69 65.41,59.69 66.67,60.96 66.67,73.66 67.94,74.93 72.39,74.93 73.66,76.2 LED22.A
R7  (via drill 0.6 pad 1.68)
  Top 0.61: v62.23,72.39 v68.58,72.39
  Bottom 0.61: IC2.15 60.33,71.12 61.59,72.39 v62.23,72.39 | v68.58,72.39 69.85,72.39 71.12,73.66 85.72,73.66 87,74.93 LED23.A
R8  (via drill 0.6 pad 1.68)
  Top 0.61: v68.58,69.85 v62.23,69.85
  Bottom 0.61: IC2.16 57.78,64.14 58.42,63.5 61.59,63.5 62.23,64.14 v62.23,69.85 | LED24.A 100.33,73.66 99.06,72.39 73.03,72.39 70.48,69.85 v68.58,69.85
RX1
  Bottom 0.813: X10.3 D4.C R27.2
S1
  Bottom 0.61: IC2.23 40.01,69.85 38.73,71.12 13.97,71.12 12.7,69.85 12.7,47.62 | 12.7,47.62 R33.2 | OK1.4 12.7,47.62
S2
  Bottom 0.61: IC2.24 37.47,68.58 36.2,69.85 15.24,69.85 13.97,68.58 13.97,50.8 14.61,50.16 R34.2 20.32,50.16 20.95,49.53 20.95,46.99 18.41,44.45 OK2.4
S3
  Bottom 0.61: IC2.25 34.92,67.31 33.66,68.58 16.51,68.58 15.24,67.31 15.24,53.34 15.88,52.7 R35.2 20.32,52.7 24.13,48.9 OK3.4
S4
  Bottom 0.61: OK4.4 29.84,45.09 19.68,55.24 R36.2 17.14,55.24 16.51,55.88 16.51,61.59 17.14,62.23 31.11,62.23 32.38,63.5 IC2.26
S5
  Bottom 0.61: IC2.4 R37.2
  Bottom 1.016: OK5.4 36.2,42.55 R37.2
S6
  Bottom 0.61: IC2.5 37.47,47.62 38.73,46.35 41.27,46.35 42.55,45.09 R38.2
  Bottom 1.016: OK6.4 43.81,42.55 R38.2
S7
  Bottom 0.61: IC2.6 40.01,48.26 40.64,47.62 45.09,47.62 46.99,45.72 48.9,45.72 50.16,44.45 R39.2
  Bottom 1.016: OK7.4 51.44,42.55 R39.2
S8
  Bottom 0.61: IC2.11 52.7,56.52 53.98,55.24 59.05,55.24
  Bottom 1.016: R40.2 59.05,42.55 OK8.4 60.33,53.98 59.05,55.24
TX1
  Bottom 0.813: X10.2 101.4,37.67 98.42,40.64 95.89,40.64 94.61,39.37 T12.C 93.98,39.37 R31.2
VCC
  Bottom 0.61: R40.1 57.78,36.83 50.16,36.83 | 50.16,36.83 42.55,36.83 | 42.55,36.83 34.92,36.83 | 34.92,36.83 8.26,36.83 | R37.1 34.92,36.83 | R38.1 42.55,36.83 | R39.1 50.16,36.83 | R35.1 R36.1 R81.1 R9.1 | R35.1 R34.1 R33.1 8.26,36.83 | IC1.8 3.17,66.04 2.54,65.41 2.54,46.99 3.81,45.72 3.81,37.47 4.45,36.83 8.26,36.83 | R35.1 R10.1 R11.1
  Bottom 0.813: 65.41,36.83 57.78,36.83 | R28.2 92.71,48.26 | R29.1 92.71,48.26 | T12.E 92.71,44.45 | 92.71,44.45 66.93,44.45 | 92.71,48.26 92.71,44.45
  Bottom 1.016: U$1.OUT+ 66.93,44.45 66.93,38.35 65.41,36.83
(copper drawn outside any net)
  shapes: Bottom area x134